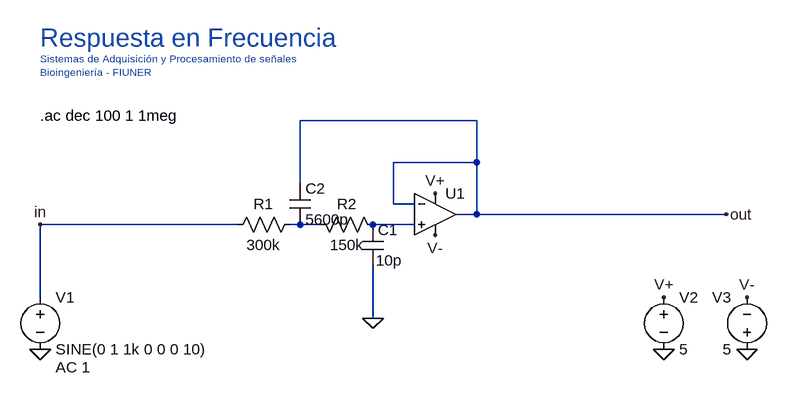
[diagram p0: schematic LTSpice_Cell1.asc]
LTSpice_Cell1.asc, the LTspice schematic file:
Version 4
SHEET 1 1092 680
WIRE 640 -160 368 -160
WIRE 640 -96 640 -160
WIRE 640 -96 512 -96
WIRE 368 -64 368 -160
WIRE 512 -32 512 -96
WIRE 544 -32 512 -32
WIRE 640 -16 640 -96
WIRE 640 -16 608 -16
WIRE 1024 -16 640 -16
WIRE 272 0 -32 0
WIRE 368 0 352 0
WIRE 400 0 368 0
WIRE 544 0 480 0
WIRE -32 112 -32 0
WIRE 480 144 480 64
FLAG -32 192 0
FLAG 480 144 0
FLAG -32 0 in
FLAG 1024 -16 out
FLAG 576 16 V-
FLAG 576 -48 V+
FLAG 928 112 V+
FLAG 1056 112 V-
FLAG 928 192 0
FLAG 1056 192 0
SYMBOL voltage -32 96 R0
WINDOW 123 24 124 Left 2
WINDOW 39 0 0 Left 2
SYMATTR Value2 AC 1
SYMATTR InstName V1
SYMATTR Value SINE(0 1 1k 0 0 0 10)
SYMBOL res 368 -16 R90
WINDOW 0 0 56 VBottom 2
WINDOW 3 32 56 VTop 2
SYMATTR InstName R1
SYMATTR Value 300k
SYMBOL cap 464 0 R0
WINDOW 3 21 55 Left 2
SYMATTR Value 10p
SYMATTR InstName C1
SYMBOL Opamps\\UniversalOpamp2 576 -16 R0
SYMATTR InstName U1
SYMBOL voltage 928 96 R0
WINDOW 123 0 0 Left 2
WINDOW 39 0 0 Left 2
SYMATTR InstName V2
SYMATTR Value 5
SYMBOL voltage 1056 208 R180
WINDOW 0 24 96 Left 2
WINDOW 3 24 16 Left 2
WINDOW 123 0 0 Left 2
WINDOW 39 0 0 Left 2
SYMATTR InstName V3
SYMATTR Value 5
SYMBOL cap 352 -64 R0
SYMATTR InstName C2
SYMATTR Value 5600p
SYMBOL res 384 -16 M90
WINDOW 0 0 56 VBottom 2
WINDOW 3 32 56 VTop 2
SYMATTR InstName R2
SYMATTR Value 150k
TEXT -32 -256 Left 1 ;Sistemas de Adquisición y Procesamiento de señales\nBioingeniería - FIUNER
TEXT -32 -288 Left 4 ;Respuesta en Frecuencia
TEXT -32 -168 Left 2 !.ac dec 100 1 1meg

The netlist it stands for:
* LTSpice_Cell1.asc
V1 in 0 SINE(0 1 1k 0 0 0 10) AC 1
R1 N001 in 300k
C1 N002 0 10p
XU1 N002 out V+ V- out level.2 Avol=1Meg GBW=10Meg Slew=10Meg ilimit=25m rail=0 Vos=0 phimargin=45 en=0 enk=0 in=0 ink=0 Rin=500Meg  ; pins IN+ IN- V+ V- OUT
V2 V+ 0 5
V3 0 V- 5
C2 out N001 5600p
R2 N001 N002 150k
* Sistemas de Adquisición y Procesamiento de señales
* Bioingeniería - FIUNER
* Respuesta en Frecuencia
.ac dec 100 1 1meg
.lib UniversalOpamps2.sub
.backanno
.end